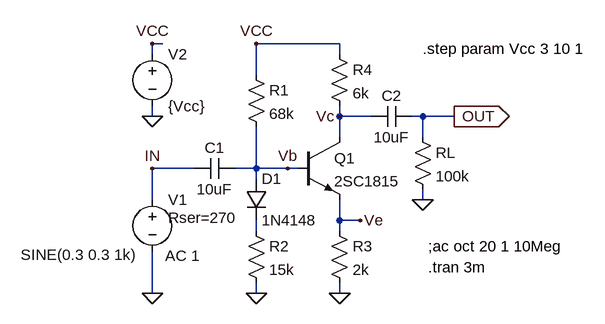
[diagram p0: schematic EmitterCommon_Diode.asc]
EmitterCommon_Diode.asc, the LTspice schematic file:
Version 4
SHEET 1 880 680
WIRE 16 -16 0 -16
WIRE 288 -16 160 -16
WIRE 0 0 0 -16
WIRE 288 0 288 -16
WIRE 160 32 160 -16
WIRE 0 96 0 80
WIRE 288 96 288 80
WIRE 336 96 288 96
WIRE 416 96 400 96
WIRE 464 96 416 96
WIRE 288 128 288 96
WIRE 416 128 416 96
WIRE 64 176 0 176
WIRE 160 176 160 112
WIRE 160 176 128 176
WIRE 208 176 160 176
WIRE 224 176 208 176
WIRE 160 192 160 176
WIRE 0 224 0 176
WIRE 416 224 416 208
WIRE 288 256 288 224
WIRE 320 256 288 256
WIRE 160 272 160 256
WIRE 288 272 288 256
WIRE 0 368 0 304
WIRE 160 368 160 352
WIRE 288 368 288 352
FLAG 0 368 0
FLAG 160 368 0
FLAG 288 368 0
FLAG 464 96 OUT
IOPIN 464 96 Out
FLAG 160 -16 VCC
FLAG 0 96 0
FLAG 0 -16 VCC
FLAG 0 176 IN
FLAG 208 176 Vb
FLAG 320 256 Ve
FLAG 288 96 Vc
FLAG 416 224 0
SYMBOL npn 224 128 R0
SYMATTR InstName Q1
SYMATTR Value 2SC1815
SYMBOL cap 128 160 R90
WINDOW 0 0 32 VBottom 2
WINDOW 3 32 32 VTop 2
SYMATTR InstName C1
SYMATTR Value 10uF
SYMBOL res 144 16 R0
SYMATTR InstName R1
SYMATTR Value 68k
SYMBOL res 144 256 R0
SYMATTR InstName R2
SYMATTR Value 15k
SYMBOL voltage 0 208 R0
WINDOW 3 -24 101 Right 2
WINDOW 123 20 102 Left 2
WINDOW 39 24 44 Left 2
SYMATTR Value SINE(0.3 0.3 1k)
SYMATTR Value2 AC 1
SYMATTR SpiceLine Rser=270
SYMATTR InstName V1
SYMBOL res 272 256 R0
SYMATTR InstName R3
SYMATTR Value 2k
SYMBOL res 272 -16 R0
SYMATTR InstName R4
SYMATTR Value 6k
SYMBOL voltage 0 -16 R0
WINDOW 123 0 0 Left 2
WINDOW 39 0 0 Left 2
SYMATTR InstName V2
SYMATTR Value {Vcc}
SYMBOL cap 400 80 R90
WINDOW 0 0 32 VBottom 2
WINDOW 3 32 32 VTop 2
SYMATTR InstName C2
SYMATTR Value 10uF
SYMBOL res 400 112 R0
SYMATTR InstName RL
SYMATTR Value 100k
SYMBOL diode 144 192 R0
SYMATTR InstName D1
SYMATTR Value 1N4148
TEXT 424 328 Left 2 !.tran 3m
TEXT 424 296 Left 2 !;ac oct 20 1 10Meg
TEXT 416 -8 Left 2 !.step param Vcc 3 10 1

The netlist it stands for:
* EmitterCommon_Diode.asc
Q1 Vc Vb Ve 0 2SC1815
C1 Vb IN 10uF
R1 VCC Vb 68k
R2 N001 0 15k
V1 IN 0 SINE(0.3 0.3 1k) AC 1 Rser=270
R3 Ve 0 2k
R4 VCC Vc 6k
V2 VCC 0 {Vcc}
C2 OUT Vc 10uF
RL OUT 0 100k
D1 Vb N001 1N4148
.model D D
.lib standard.dio
.model NPN NPN
.model PNP PNP
.lib standard.bjt
.tran 3m
;ac oct 20 1 10Meg
.step param Vcc 3 10 1
.backanno
.end